# Altium schematic sheet llrf_afe_rio.SchDoc: =GlobalProjectName
size 209 x 297 mm; SheetNumber: 5; SheetTotal: 17; PageSetup: Record=PageOptions|CenterHorizontal=True|CenterVertical=True|PrintScale=1.00|XCorrection=1.00|YCorrection=1.00|PrintKind=1|BorderSize=5000000|LeftOffset=0|BottomOffset=0|Orientation=2|PaperLength=1000|PaperWidth=1000|Scale=100|PaperSource=15|PrintQuality=1200|MediaType=1|DitherType=10|PaperKind=A3|PrintScaleMode=1; Weight: -; ScaleFactor: -
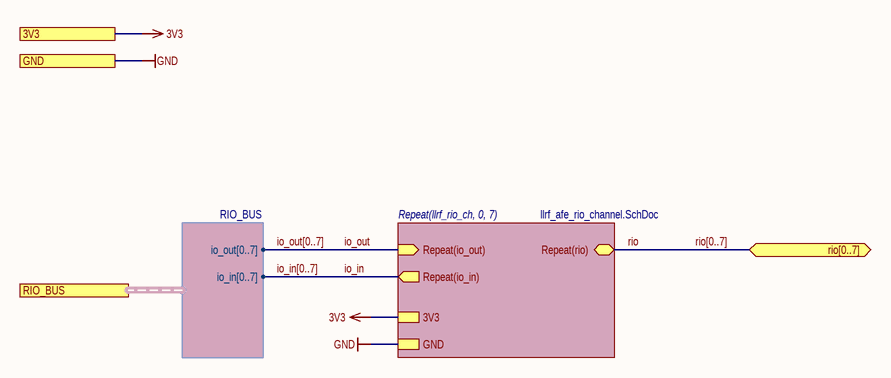
[diagram p0: llrf_afe_rio.SchDoc]

## Sub-sheets
Repeat(llrf_rio_ch, 0, 7) = llrf_afe_rio_channel.SchDoc: Repeat(io_in) (out), GND, Repeat(rio) (bidir), Repeat(io_out) (in), 3V3

## Ports
3V3, GND, rio[0..7] (bidir), RIO_BUS (harness RIO_BUS)

## Harnesses
RIO_BUS: io_out[0..7], io_in[0..7]

## Nets
3V3: port 3V3, sheet Repeat(llrf_rio_ch, 0, 7)/3V3
GND: port GND, sheet Repeat(llrf_rio_ch, 0, 7)/GND
io_in: sheet Repeat(llrf_rio_ch, 0, 7)/Repeat(io_in)
io_out: sheet Repeat(llrf_rio_ch, 0, 7)/Repeat(io_out)
rio: sheet Repeat(llrf_rio_ch, 0, 7)/Repeat(rio)

## Buses and harness runs
bus io_in[0..7]
bus io_out[0..7]
bus rio[0..7] = port rio[0..7]

## Notes on the sheet
- Подп. и дата
- Инв. № дубл.
- Взам. инв. №
- Инв. № подл.
- Изм.
- Лист
- № докум.
- Подп.
- Дата
- Форма 2а ГОСТ 2.104-2006
- Копировал
- Формат А4